# EAGLE design tx new (EAGLE 9.5.0)
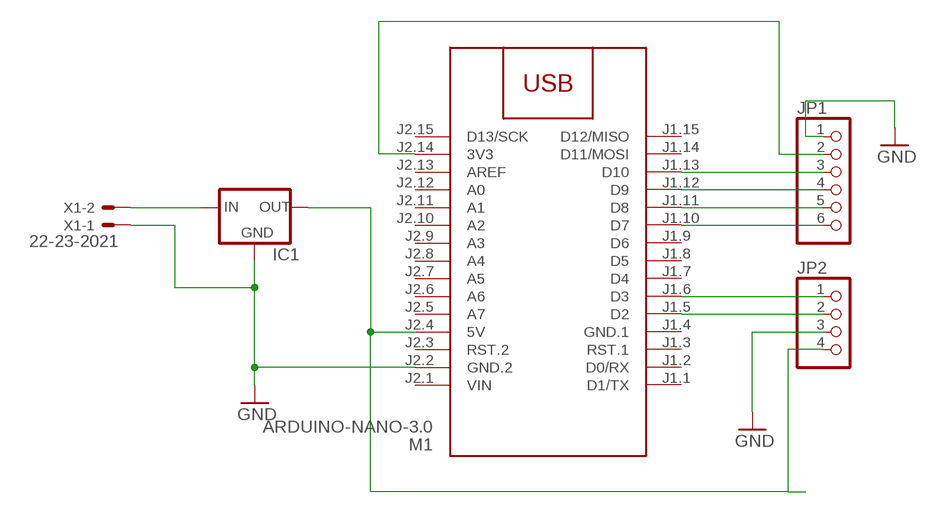
[diagram p0: schematic, sheet 1]

## Parts
IC1  78XXS  [78XXS]
JP1  PINHD-1X6  [1X06]
JP2  PINHD-1X4  [1X04]
M1  ARDUINO-NANO-3.0  [ARDUINO-NANO-3.0]
X1  22-23-2021  [22-23-2021]

## Nets
GND: IC1.GND JP1.1 JP2.3 M1.J2.2(GND.2) X1.1
N$1: IC1.IN X1.2
N$2: JP2.1 M1.J1.6(D3)
N$3: IC1.OUT JP2.4 M1.J2.4(5V)
N$4: JP1.2 M1.J2.14(3V3)
N$5: JP1.3 M1.J1.13(D10)
N$6: JP1.4 M1.J1.12(D9)
N$7: JP1.5 M1.J1.11(D8)
N$8: JP1.6 M1.J1.10(D7)
N$9: JP2.2 M1.J1.5(D2)
Unconnected: M1.J1.1(D1/TX) M1.J1.2(D0/RX) M1.J1.3(RST.1) M1.J1.7(D4) M1.J1.8(D5) M1.J1.9(D6) M1.J1.14(D11/MOSI) M1.J1.15(D12/MISO) M1.J2.3(RST.2) M1.J2.5(A7) M1.J2.6(A6) M1.J2.7(A5) M1.J2.8(A4) M1.J2.9(A3) M1.J2.10(A2) M1.J2.11(A1) M1.J2.12(A0) M1.J2.13(AREF) M1.J2.15(D13/SCK)

## Power pins joined to a net without a drawn wire
GND.1: M1.J1.4(GND.1)
VIN: M1.J2.1(VIN)

## Library data of the parts
IC1 = v-reg:78XXS: VOLTAGE REGULATOR
JP1 = pinhead:PINHD-1X6: PIN HEADER
JP2 = pinhead:PINHD-1X4: PIN HEADER
M1 = diy-modules:ARDUINO-NANO-3.0: Arduino Nano 3.0 and compatible devices More details available here: https://www.arduino.cc/en/Main/ArduinoBoardNano Click here to find device on ebay.com <http://www.ebay.com/sch/arduino+nano>
X1 = con-molex:22-23-2021: .100" (2.54mm) Center Header - 2 Pin; MF: MOLEX; MPN: 22-23-2021; OC_FARNELL: 1462926; OC_NEWARK: 25C3832

## Board
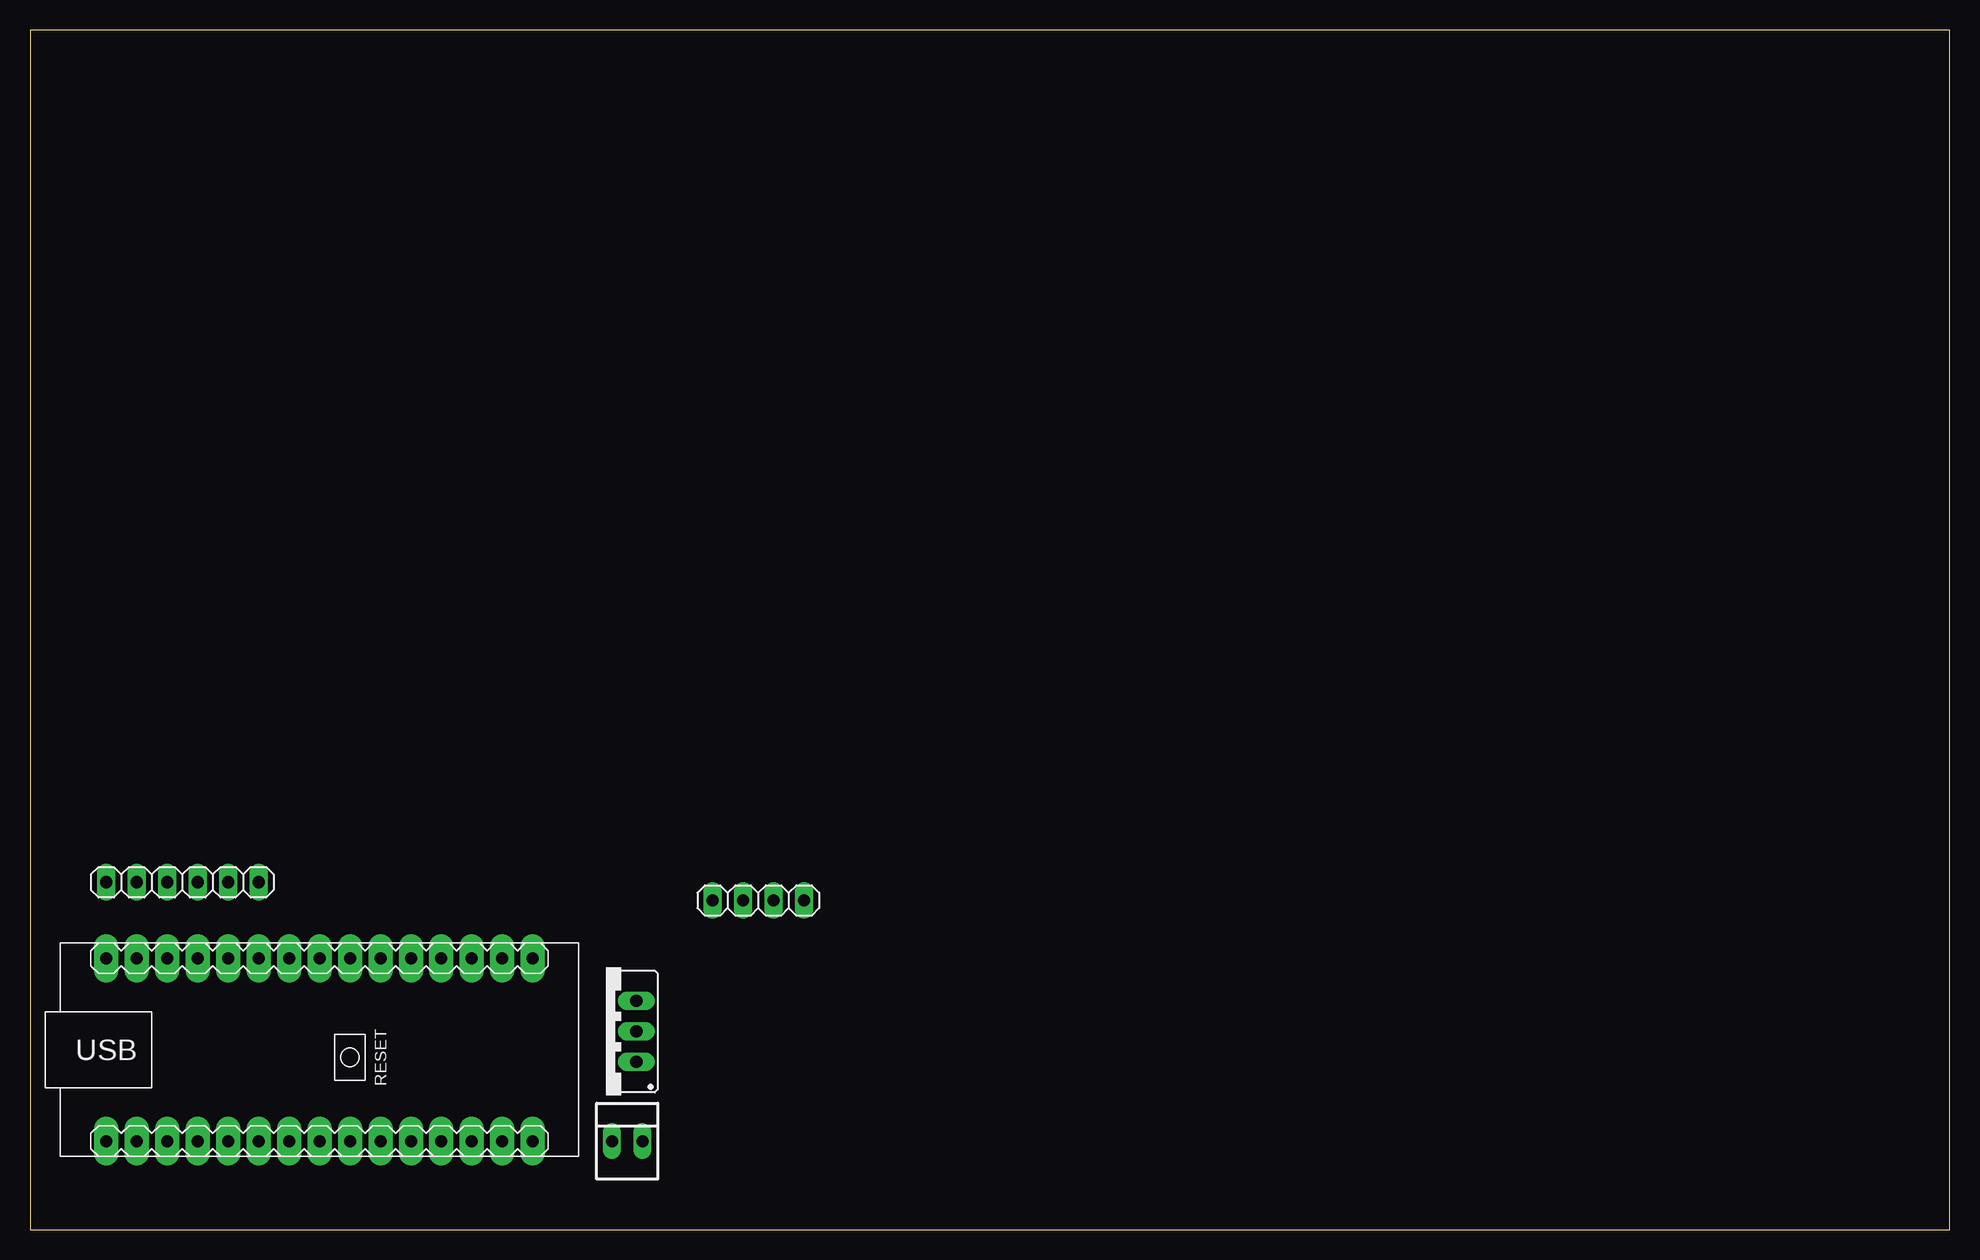
[diagram p1: board, top side]
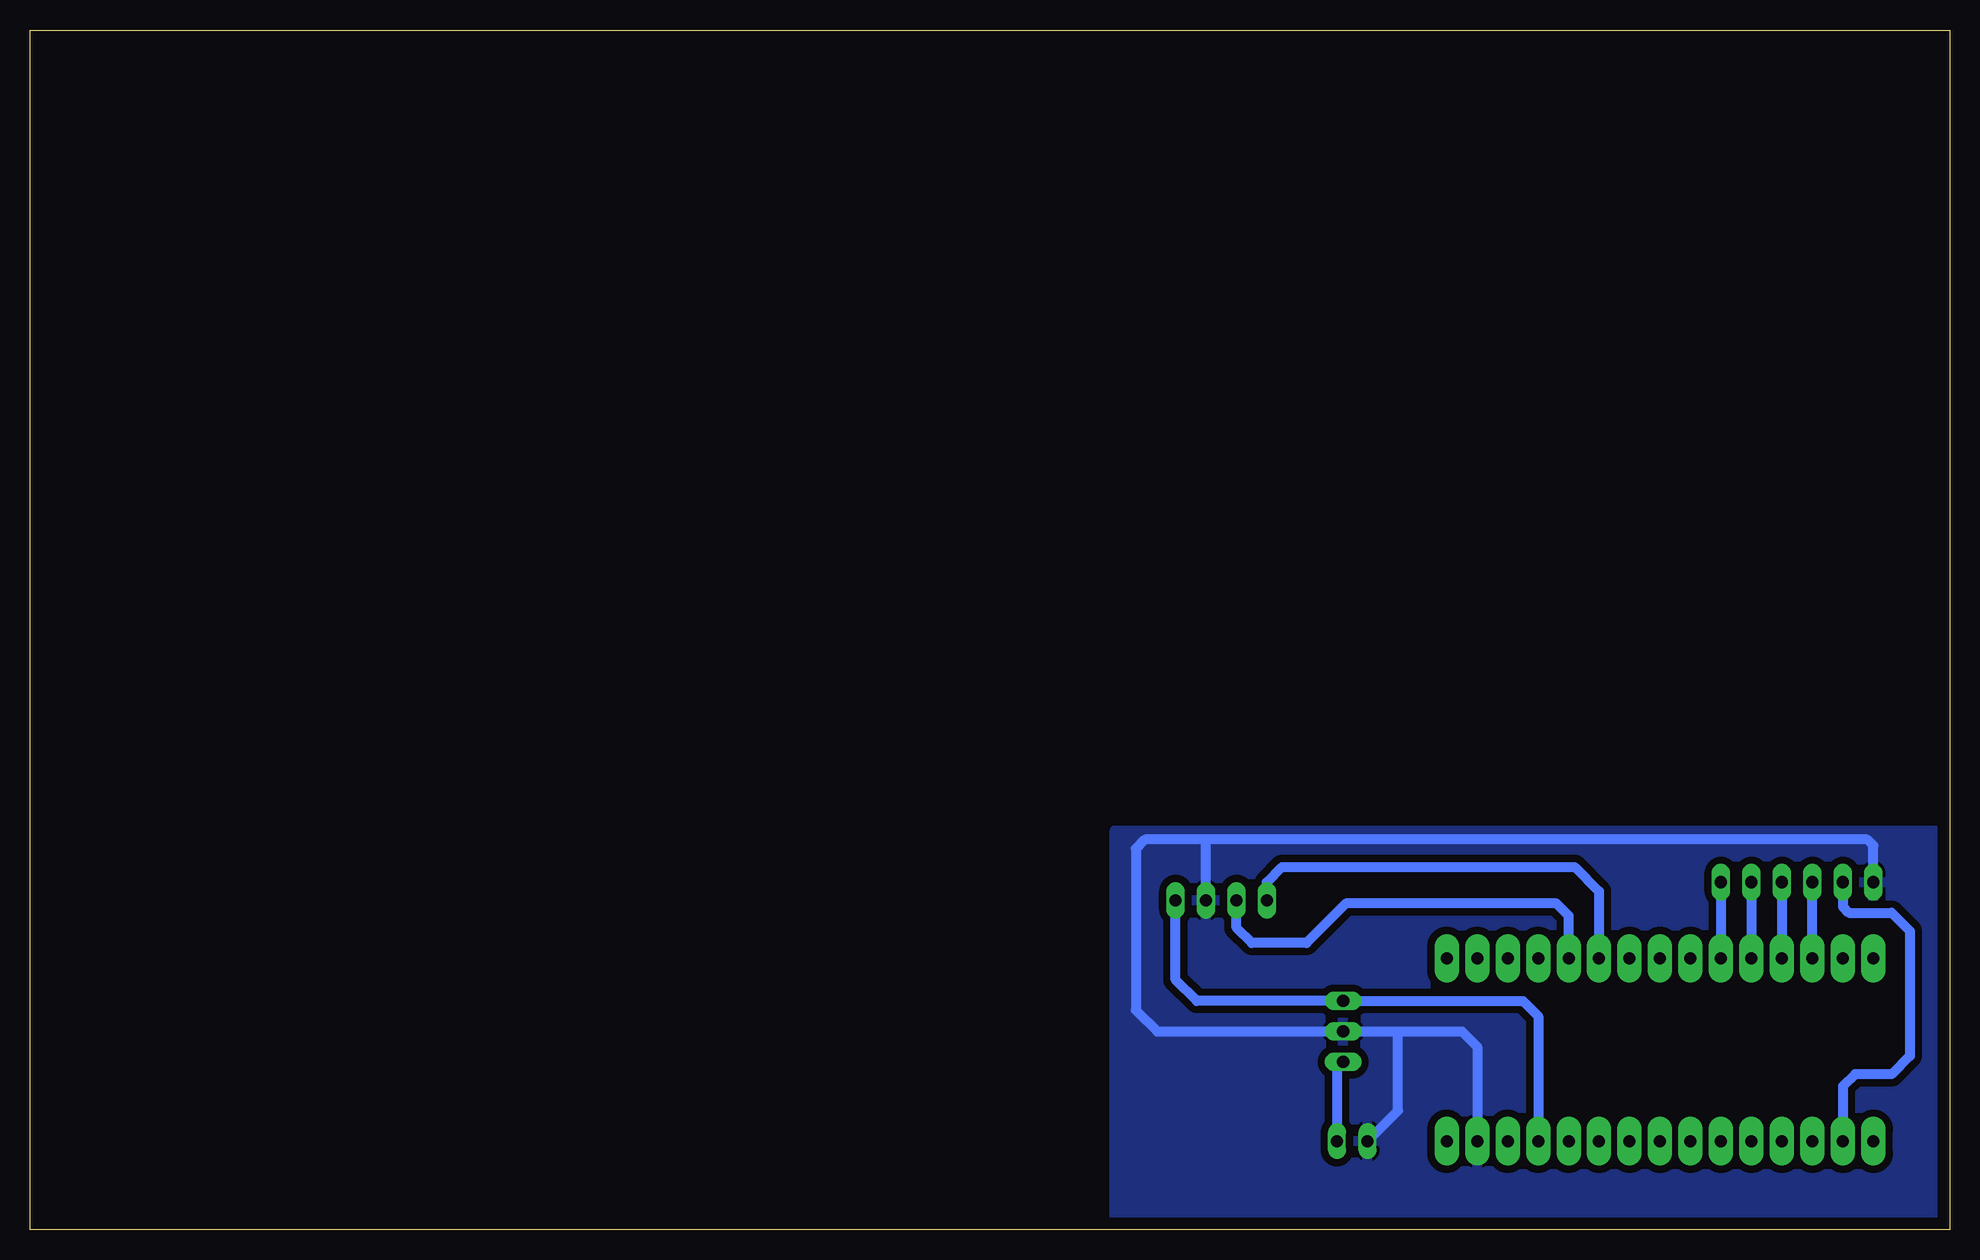
[diagram p2: board, bottom side, seen from below]

Size 160 x 100 mm. Coordinates in mm from the lower left corner, seen from the top.
Outline: 0,0 160,0 160,100 0,100 0,0
Copper layers (1*16): Top 0.035mm / dielectric 1.5mm / Bottom 0.035mm
Design rules "default": minimum track width 6mil, minimum drill 0.35mm, track to track 24mil, track to pad 24mil, pad to pad 24mil, via to via 24mil, smd to smd 24mil, copper to edge 40mil, drill to drill 6mil, minimum pad ring 10mil, minimum via ring 8mil, stop-mask expansion 4mil, vias tented up to drill 0mil, thermal gap 10mil

### Footprints (pad centres in the part's own frame; a part is rotated, then mirrored left to right if it is on the bottom)
78XXS = drill 1.016 long: GND 0,-2.54; IN -2.54,-2.54; OUT 2.54,-2.54
1X06 = drill 1.016 long: 1 -6.35,0; 2 -3.81,0; 3 -1.27,0; 4 1.27,0; 5 3.81,0; 6 6.35,0
1X04 = drill 1.016 long: 1 -3.81,0; 2 -1.27,0; 3 1.27,0; 4 3.81,0
ARDUINO-NANO-3.0 = drill 1 pad 2.032 long: J1.1 17.78,7.62; J1.2 15.24,7.62; J1.3 12.7,7.62; J1.4 10.16,7.62; J1.5 7.62,7.62; J1.6 5.08,7.62; J1.7 2.54,7.62; J1.8 0,7.62; J1.9 -2.54,7.62; J1.10 -5.08,7.62; J1.11 -7.62,7.62; J1.12 -10.16,7.62; J1.13 -12.7,7.62; J1.14 -15.24,7.62; J1.15 -17.78,7.62; J2.1 17.78,-7.62; J2.2 15.24,-7.62; J2.3 12.7,-7.62; J2.4 10.16,-7.62; J2.5 7.62,-7.62; J2.6 5.08,-7.62; J2.7 2.54,-7.62; J2.8 0,-7.62; J2.9 -2.54,-7.62; J2.10 -5.08,-7.62; J2.11 -7.62,-7.62; J2.12 -10.16,-7.62; J2.13 -12.7,-7.62; J2.14 -15.24,-7.62; J2.15 -17.78,-7.62
22-23-2021 = drill 1 long: 1 -1.27,0; 2 1.27,0

### Placement (x,y rotation side)
IC1  48.01,16.51 90 top
JP1  12.7,28.96 0 top
JP2  60.71,27.43 0 top
M1  24.13,14.99 0 top
X1  49.78,7.37 0 top

### Tracks (layer width: path | path; a pad name or v marks a point on that pad's centre or on a via)
GND
  Bottom 0.813: 45.97,16.51 IC1.GND 66.04,16.51 67.82,18.29 67.82,31.75 67.06,32.51 62.23,32.51 | 45.97,16.51 40.64,16.51 39.37,15.24 M1.J2.2 | JP1.1 6.35,32 6.86,32.51 62.23,32.51 | JP2.3 61.98,32.26 62.23,32.51 | X1.1 45.97,9.91 45.97,16.51
  pour Bottom: 6.6,33.27 0.25,33.27 0.25,0.76 69.6,0.76 69.6,32.77 69.6,33.27
N$1
  Bottom 0.813: IC1.IN 51.05,13.46 X1.2
N$2
  Bottom 0.813: JP2.1 56.9,28.96 55.63,30.23 31.24,30.23 29.21,28.19 M1.J1.6
N$3
  Bottom 0.813: M1.J2.4 34.29,17.78 35.56,19.05 IC1.OUT 62.74,19.05 64.52,20.83 JP2.4
N$4
  Bottom 0.813: JP1.2 8.89,26.92 8.38,26.42 4.83,26.42 3.3,24.89 3.3,14.48 4.83,12.95 7.87,12.95 8.89,11.94 M1.J2.14
N$5
  Bottom 0.813: M1.J1.13 JP1.3
N$6
  Bottom 0.813: JP1.4 M1.J1.12
N$7
  Bottom 0.813: JP1.5 M1.J1.11
N$8
  Bottom 0.813: JP1.6 M1.J1.10
N$9
  Bottom 0.813: M1.J1.5 31.75,26.16 32.77,27.18 50.29,27.18 53.59,23.88 58.17,23.88 59.44,25.15 JP2.2